# EAGLE design ControlBoard (EAGLE 8.1.0)

## Sheet 1 of 8
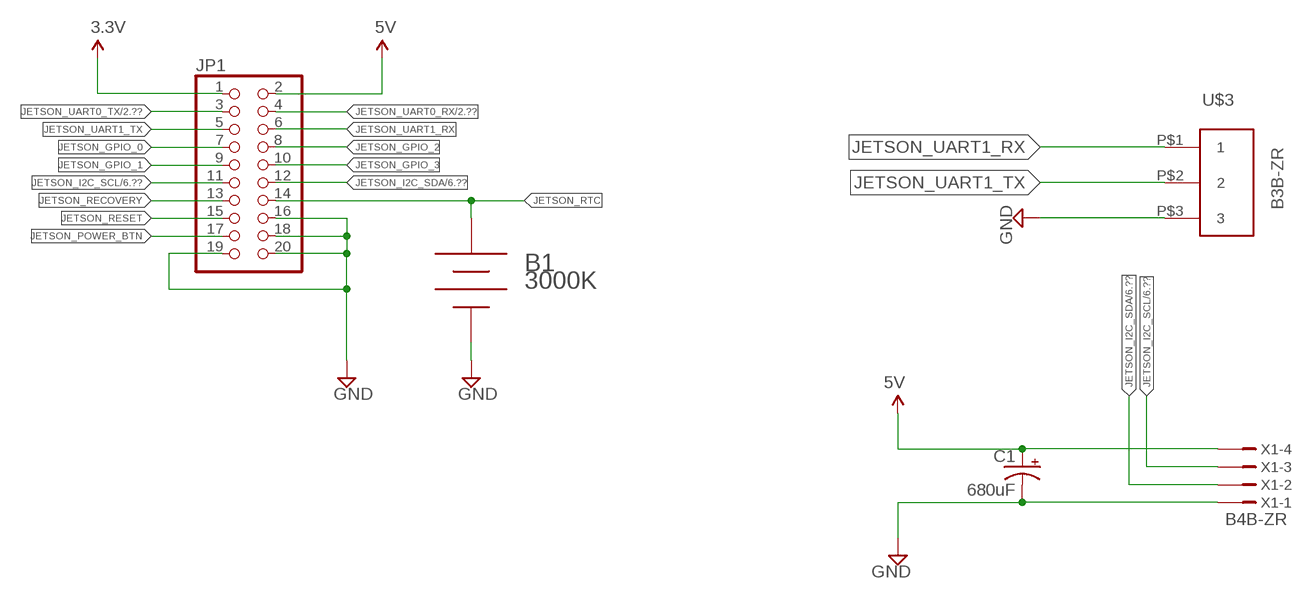
[diagram p0: schematic, sheet 1]

### Parts
B1  3000K  [3000K]
C1  680uF  CAP_POLPTH4  [CPOL-RADIAL-1000UF-25V]
JP1  PINHD-2X10  [2X10]
U$3  B3B-ZR  [3PIN-1.5MM]
X1  B4B-ZR  [B4B-ZR]

### Nets
3.3V: JP1.1 ; also sheet 2,4
5V: C1.+ JP1.2 X1.4 ; also sheet 2,5,6,8
GND: B1.- C1.- JP1.16 JP1.18 JP1.19 JP1.20 U$3.P$3 X1.1 ; also sheet 2,3,4,5,6,7,8
JETSON_GPIO_0: JP1.7
JETSON_GPIO_1: JP1.9
JETSON_GPIO_2: JP1.8
JETSON_GPIO_3: JP1.10
JETSON_I2C_SCL: JP1.11 X1.3 ; also sheet 6
JETSON_I2C_SDA: JP1.12 X1.2 ; also sheet 6
JETSON_POWER_BTN: JP1.17
JETSON_RECOVERY: JP1.13
JETSON_RESET: JP1.15
JETSON_RTC: B1.+ JP1.14
JETSON_UART0_RX: JP1.4 ; also sheet 2
JETSON_UART0_TX: JP1.3 ; also sheet 2
JETSON_UART1_RX: JP1.6 U$3.P$1
JETSON_UART1_TX: JP1.5 U$3.P$2

## Sheet 2 of 8
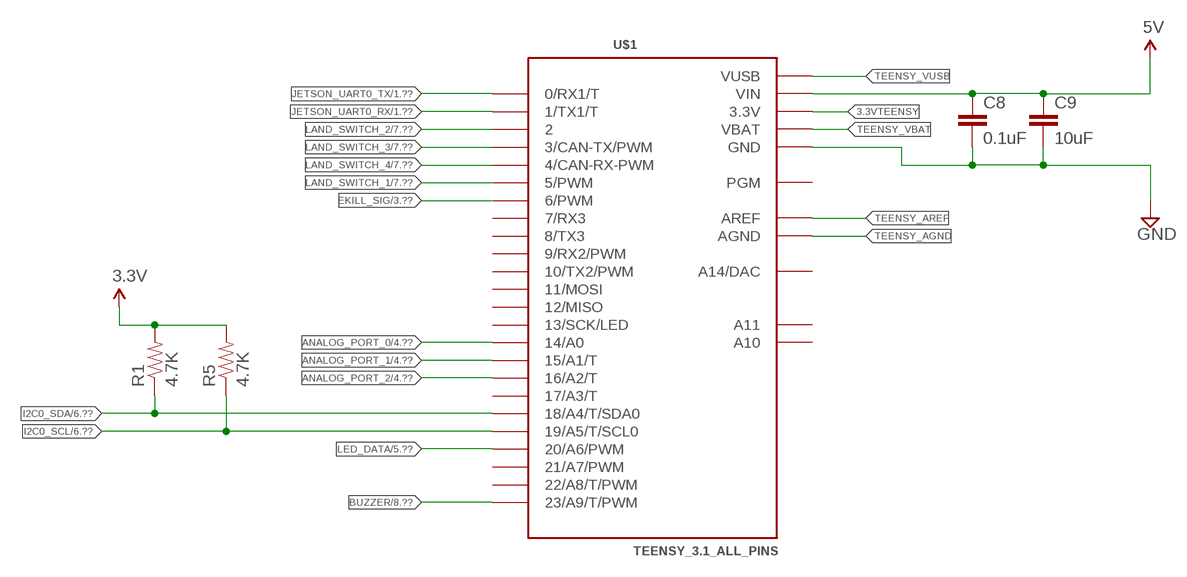
[diagram p1: schematic, sheet 2]

### Parts
C8  0.1uF  CAP0603-CAP  [0603-CAP]
C9  10uF  CAP0603-CAP  [0603-CAP]
R1  4.7K  RESISTOR0603  [0603-RES]
R5  4.7K  RESISTOR0603  [0603-RES]
U$1  TEENSY_3.1_ALL_PINS  [TEENSY3-ALL_PINS]

### Nets
3.3V: R1.2 R5.2 ; also sheet 1,4
3.3VTEENSY: U$1.3.3V U$1.3.3V1(3.3V)
5V: C8.1 C9.1 U$1.VIN ; also sheet 1,5,6,8
ANALOG_PORT_0: U$1.14/A0 ; also sheet 4
ANALOG_PORT_1: U$1.15/A1(15/A1/T) ; also sheet 4
ANALOG_PORT_2: U$1.16/A2(16/A2/T) ; also sheet 4
BUZZER: U$1.23/A9(23/A9/T/PWM) ; also sheet 8
EKILL_SIG: U$1.6(6/PWM) ; also sheet 3
GND: C8.2 C9.2 U$1.GND U$1.GND1(GND) ; also sheet 1,3,4,5,6,7,8
I2C0_SCL: R5.1 U$1.19/A5(19/A5/T/SCL0) ; also sheet 6
I2C0_SDA: R1.1 U$1.18/A4(18/A4/T/SDA0) ; also sheet 6
JETSON_UART0_RX: U$1.1(1/TX1/T) ; also sheet 1
JETSON_UART0_TX: U$1.0(0/RX1/T) ; also sheet 1
LAND_SWITCH_1: U$1.5(5/PWM) ; also sheet 7
LAND_SWITCH_2: U$1.2 ; also sheet 7
LAND_SWITCH_3: U$1.3(3/CAN-TX/PWM) ; also sheet 7
LAND_SWITCH_4: U$1.4(4/CAN-RX-PWM) ; also sheet 7
LED_DATA: U$1.20/A6(20/A6/PWM) ; also sheet 5
TEENSY_AGND: U$1.AGND
TEENSY_AREF: U$1.AREF
TEENSY_VBAT: U$1.VBAT
TEENSY_VUSB: U$1.VUSB
Unconnected: U$1.7(7/RX3) U$1.8(8/TX3) U$1.9(9/RX2/PWM) U$1.10(10/TX2/PWM) U$1.11(11/MOSI) U$1.12(12/MISO) U$1.13(13/SCK/LED) U$1.17/A3(17/A3/T) U$1.21/A7(21/A7/PWM) U$1.22/A8(22/A8/T/PWM) U$1.A10 U$1.A11 U$1.PGM U$1.RESET/DAC(A14/DAC)

## Sheet 3 of 8
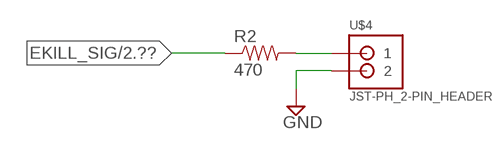
[diagram p2: schematic, sheet 3]

### Parts
R2  470  RESISTOR0603  [0603-RES]
U$4  JST-PH_2-PIN_HEADER  [JST_B2B-PH_HEADER]

### Nets
EKILL_SIG: R2.1 ; also sheet 2
GND: U$4.P2 ; also sheet 1,2,4,5,6,7,8
N$4: R2.2 U$4.P1

## Sheet 4 of 8
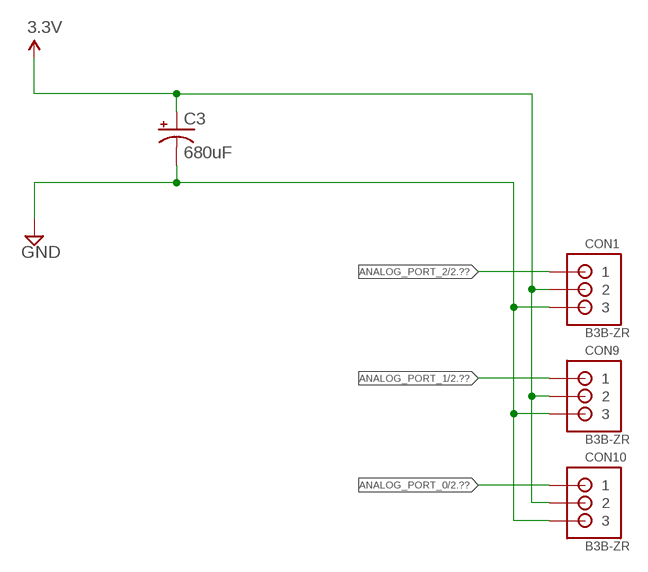
[diagram p3: schematic, sheet 4]

### Parts
C3  680uF  CAP_POLPTH4  [CPOL-RADIAL-1000UF-25V]
CON1  B3B-ZR  [B3B-ZR]
CON9  B3B-ZR  [B3B-ZR]
CON10  B3B-ZR  [B3B-ZR]

### Nets
3.3V: C3.+ CON1.2 CON9.2 CON10.2 ; also sheet 1,2
ANALOG_PORT_0: CON10.1 ; also sheet 2
ANALOG_PORT_1: CON9.1 ; also sheet 2
ANALOG_PORT_2: CON1.1 ; also sheet 2
GND: C3.- CON1.3 CON9.3 CON10.3 ; also sheet 1,2,3,5,6,7,8

## Sheet 5 of 8
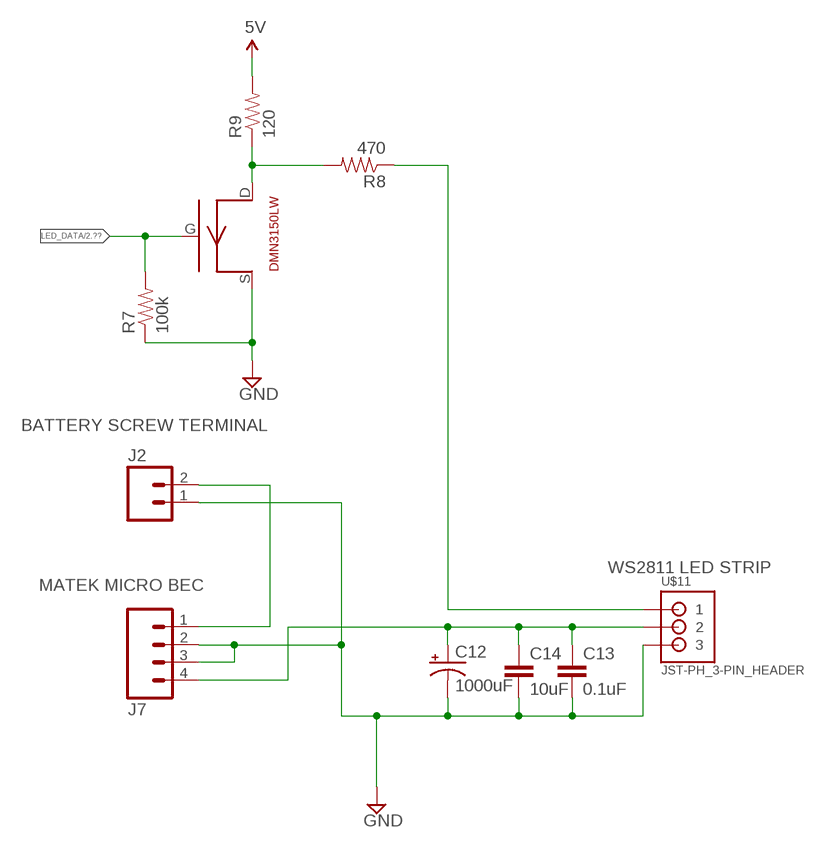
[diagram p4: schematic, sheet 5]

### Parts
C12  1000uF  CAP_POLPTH4  [CPOL-RADIAL-1000UF-25V]
C13  0.1uF  CAP0603-CAP  [0603-CAP]
C14  10uF  CAP0603-CAP  [0603-CAP]
J2  M025MM  [SCREWTERMINAL-5MM-2]
J7  M04PTH  [1X04]
R7  100k  RESISTOR0603-RES  [0603-RES]
R8  470  RESISTOR0603  [0603-RES]
R9  120  RESISTOR0603  [0603-RES]
U$2  DMN3150LW  [DMN3150LW]
U$11  JST-PH_3-PIN_HEADER  [JST_B3B-PH_HEADER]

### Nets
5V: R9.2 ; also sheet 1,2,6,8
GND: C12.2(-) C13.2 C14.2 J2.1 J7.2 J7.3 R7.1 U$2.S U$11.P3 ; also sheet 1,2,3,4,6,7,8
LED_DATA: R7.2 U$2.G ; also sheet 2
N$10: J2.2 J7.1
N$14: C12.1(+) C13.1 C14.1 J7.4 U$11.P2
N$15: R8.1 U$11.P1
N$16: R8.2 R9.1 U$2.D

### Notes on the sheet
- BATTERY SCREW TERMINAL
- WS2811 LED STRIP
- MATEK MICRO BEC

## Sheet 6 of 8
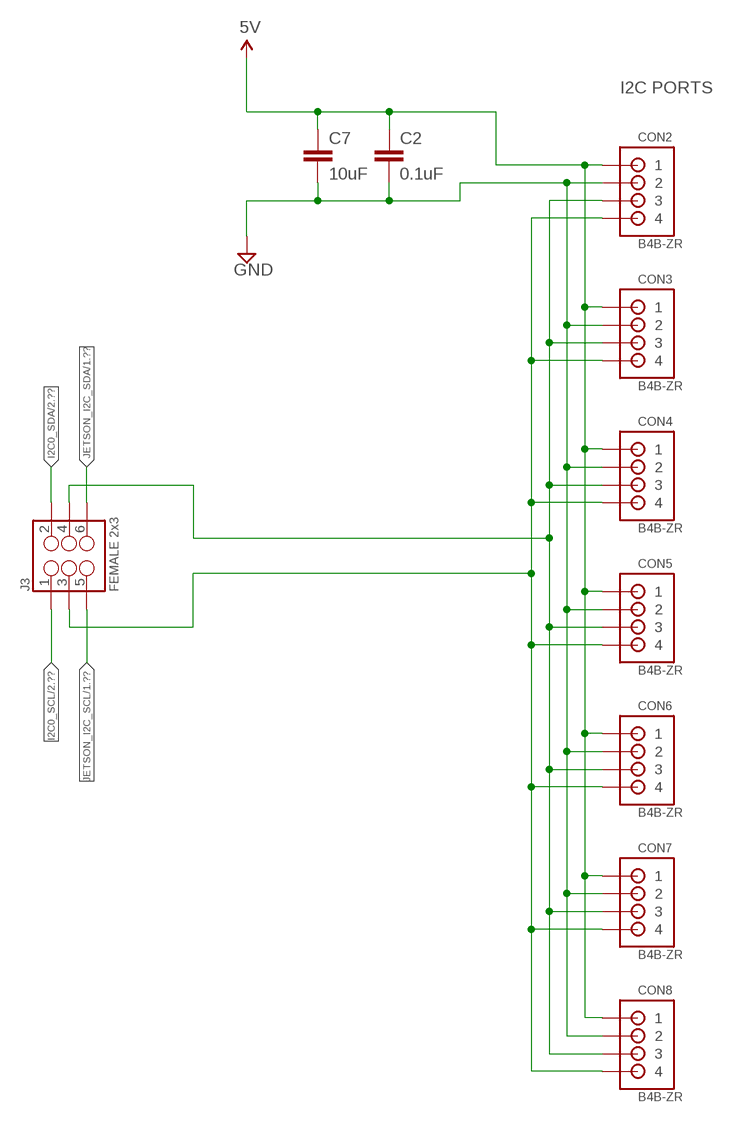
[diagram p5: schematic, sheet 6]

### Parts
C2  0.1uF  CAP0603-CAP  [0603-CAP]
C7  10uF  CAP0603-CAP  [0603-CAP]
CON2  B4B-ZR  [B4B-ZR]
CON3  B4B-ZR  [B4B-ZR]
CON4  B4B-ZR  [B4B-ZR]
CON5  B4B-ZR  [B4B-ZR]
CON6  B4B-ZR  [B4B-ZR]
CON7  B4B-ZR  [B4B-ZR]
CON8  B4B-ZR  [B4B-ZR]
J3  FEMALE 2x3  M03X2FEMALE  [2X3]

### Nets
5V: C2.1 C7.1 CON2.1 CON3.1 CON4.1 CON5.1 CON6.1 CON7.1 CON8.1 ; also sheet 1,2,5,8
GND: C2.2 C7.2 CON2.2 CON3.2 CON4.2 CON5.2 CON6.2 CON7.2 CON8.2 ; also sheet 1,2,3,4,5,7,8
I2C0_SCL: J3.1 ; also sheet 2
I2C0_SDA: J3.2 ; also sheet 2
JETSON_I2C_SCL: J3.5 ; also sheet 1
JETSON_I2C_SDA: J3.6 ; also sheet 1
N8: CON2.4 CON3.4 CON4.4 CON5.4 CON6.4 CON7.4 CON8.4 J3.3
N9: CON2.3 CON3.3 CON4.3 CON5.3 CON6.3 CON7.3 CON8.3 J3.4

### Notes on the sheet
- I2C PORTS

## Sheet 7 of 8
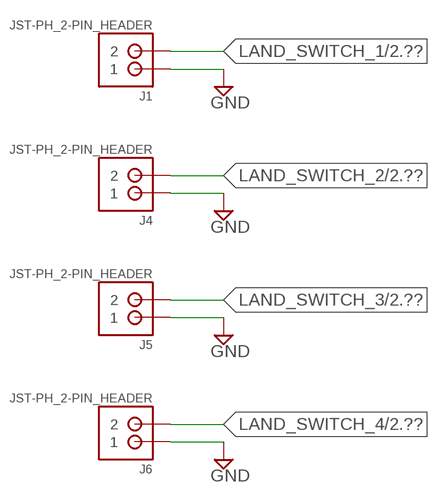
[diagram p6: schematic, sheet 7]

### Parts
J1  JST-PH_2-PIN_HEADER  [JST_B2B-PH_HEADER]
J4  JST-PH_2-PIN_HEADER  [JST_B2B-PH_HEADER]
J5  JST-PH_2-PIN_HEADER  [JST_B2B-PH_HEADER]
J6  JST-PH_2-PIN_HEADER  [JST_B2B-PH_HEADER]

### Nets
GND: J1.P1 J4.P1 J5.P1 J6.P1 ; also sheet 1,2,3,4,5,6,8
LAND_SWITCH_1: J1.P2 ; also sheet 2
LAND_SWITCH_2: J4.P2 ; also sheet 2
LAND_SWITCH_3: J5.P2 ; also sheet 2
LAND_SWITCH_4: J6.P2 ; also sheet 2

## Sheet 8 of 8
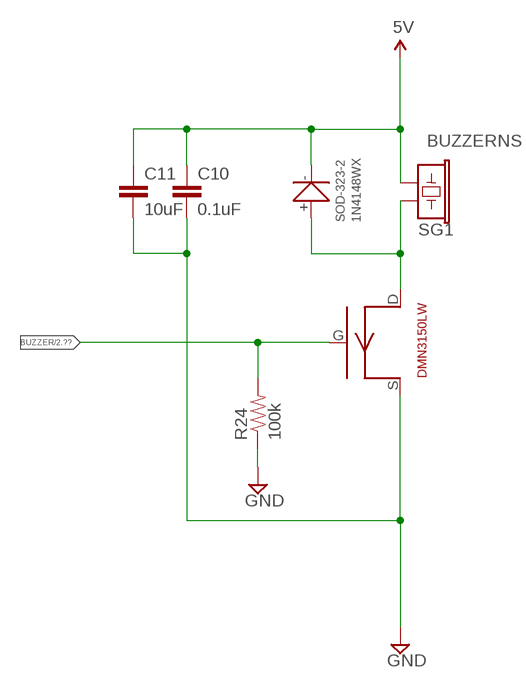
[diagram p7: schematic, sheet 8]

### Parts
C10  0.1uF  CAP0603-CAP  [0603-CAP]
C11  10uF  CAP0603-CAP  [0603-CAP]
R24  100k  RESISTOR0603-RES  [0603-RES]
SG1  BUZZERNS  [BUZZER-12MM-NS]
U$8  1N4148WX_SOD-323-2  [1N4148WX_SOD-323-2]
U$9  DMN3150LW  [DMN3150LW]

### Nets
5V: C10.1 C11.1 SG1.+ U$8.- ; also sheet 1,2,5,6
BUZZER: R24.2 U$9.G ; also sheet 2
GND: C10.2 C11.2 R24.1 U$9.S ; also sheet 1,2,3,4,5,6,7
N$12: SG1.- U$8.+ U$9.D

## Library data of the parts
B1 = b_keystone_3000k_sm_battery:3000K: SMT Battery Holder from Keystone for 12mm coin cells BR1216, CR1216, BR1220, CL1220, CR1220, BR1225
C1 C3 = SparkFun-Capacitors:CAP_POL: Capacitor Polarized These are standard SMD and PTH capacitors. Normally 10uF, 47uF, and 100uF in electrolytic and tantalum varieties. Always verify the external diameter of the through hole cap, it varies with capacity, voltage, and manufacturer. The EIA devices should be standard.
C2 C7 C13 C14 = SparkFun-Capacitors:CAP: Capacitor Standard 0603 ceramic capacitor, and 0.1" leaded capacitor.
C8-C11 = SparkFun-Passives:CAP: Capacitor Standard 0603 ceramic capacitor, and 0.1" leaded capacitor.
C12 = SparkFun-Passives:CAP_POL: Capacitor Polarized These are standard SMD and PTH capacitors. Normally 10uF, 47uF, and 100uF in electrolytic and tantalum varieties. Always verify the external diameter of the through hole cap, it varies with capacity, voltage, and manufacturer. The EIA devices should be standard.
CON1 CON9 CON10 = jst:B3B-ZR: JST-ZH Connector 3 pol, 1.5mm pitch Package: B3B-ZR Source: http://www.jst-mfg.com/product/pdf/eng/eZH.pdf
CON2-CON8 = jst:B4B-ZR: JST-ZH Connector 4 pol, 1.5mm pitch Package: B4B-ZR Source: http://www.jst-mfg.com/product/pdf/eng/eZH.pdf
J1 J4-J6 U$4 = SRG:JST-PH_2-PIN_HEADER: 2-pin JST PH Shrouded Header, top entry P/N B2B-PH-K-S Mating connector PHR-2 Mating cable assembly: Sparkfun PRT-09914 <http://www.sparkfun.com/products/9914>
J2 = SparkFun-Connectors:M02: Standard 2-pin 0.1" header. Use with - straight break away headers ( PRT-00116) - right angle break away headers (PRT-00553) - swiss pins (PRT-00743) - machine pins (PRT-00117) - female headers (PRT-00115) Molex polarized connector foot print use with: PRT-08233 with associated crimp pins and housings. 2.54_SCREWTERM for use with PRT-10571. 3.5mm Screw Terminal footprints for PRT-08084 5mm Screw Terminal footprints for use with PRT-08432; STOREFRONT_ID: PRT-08432
J3 = SparkFun-Connectors:M03X2: 2x3 .1" header. Shrouded, with keying- CONN-10681 SMT- CONN-11415 Pogo pins- HW-11044; PROD_ID: CONN-11566
J7 = SparkFun-Connectors:M04: Header 4 Standard 4-pin 0.1" header. Use with straight break away headers (SKU : PRT-00116), right angle break away headers (PRT-00553), swiss pins (PRT-00743), machine pins (PRT-00117), and female headers (PRT-00115). Molex polarized connector foot print use with SKU : PRT-08231 with associated crimp pins and housings. 1MM SMD Version SKU: PRT-10208; PROD_ID: CONN-09696
JP1 = pinhead:PINHD-2X10: PIN HEADER
R1 R2 R5 R8 R9 = SparkFun-Resistors:RESISTOR: Resistor Basic schematic elements and footprints for 0603, 1206, and PTH resistors.
R7 R24 = SparkFun-Passives:RESISTOR: Resistor Basic schematic elements and footprints for 0603, 1206, and PTH resistors.
SG1 = SparkFun-Electromechanical:BUZZER: Buzzer 12mm Spark Fun Electronics SKU : Comp-Buzzer
U$1 = Teensy_3_and_LC_Series_Boards_v1.1:TEENSY_3.1_ALL_PINS: Footprint for Teensy 3.1 or 3.2 board using all through-holes, i.e. the entire perimeter plus the 4 through-holes inboard (A10,A11,AREF, VUSB)
U$2 U$9 = DMN3150LW:DMN3150LW
U$3 = Levi-ZH:B3B-ZR: B3B-ZH 1.5mm
U$8 = 1N4148WX_SOD-323-2:1N4148WX_SOD-323-2
U$11 = SRG:JST-PH_3-PIN_HEADER: 3-pin JST PH Shrouded Header, top entry P/N B3B-PH-K-S Mating connector PHR-3
X1 = con-jst:?4B-ZR: ZH CONNECTOR 1.5 mm, 4 pin 1 row Source: http://www.jst.com .. eZH.pdf; MF: FARNELL; MPN: B4B-ZR(LF)(SN); OC_FARNELL: 1830916; OC_NEWARK: 37K9960

## Board
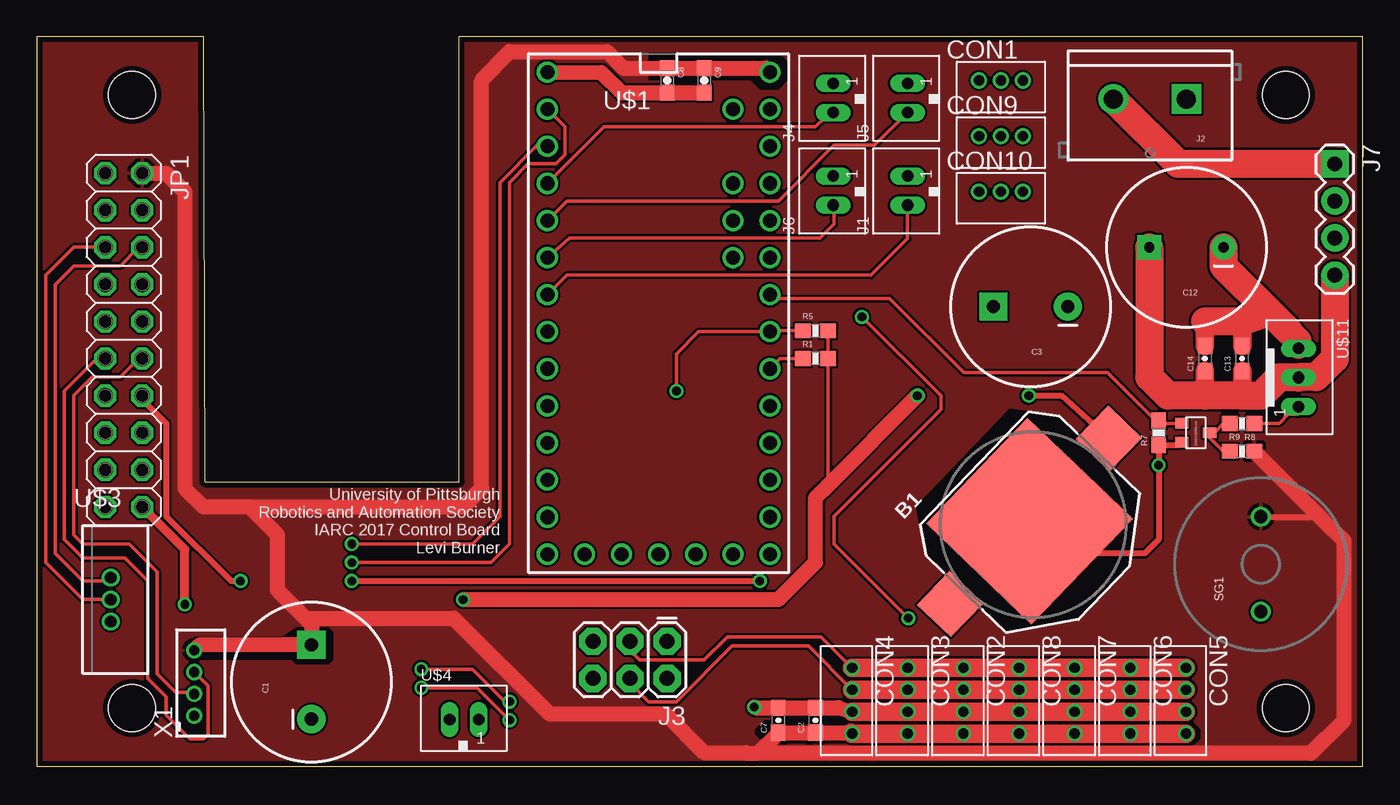
[diagram p8: board, top side]
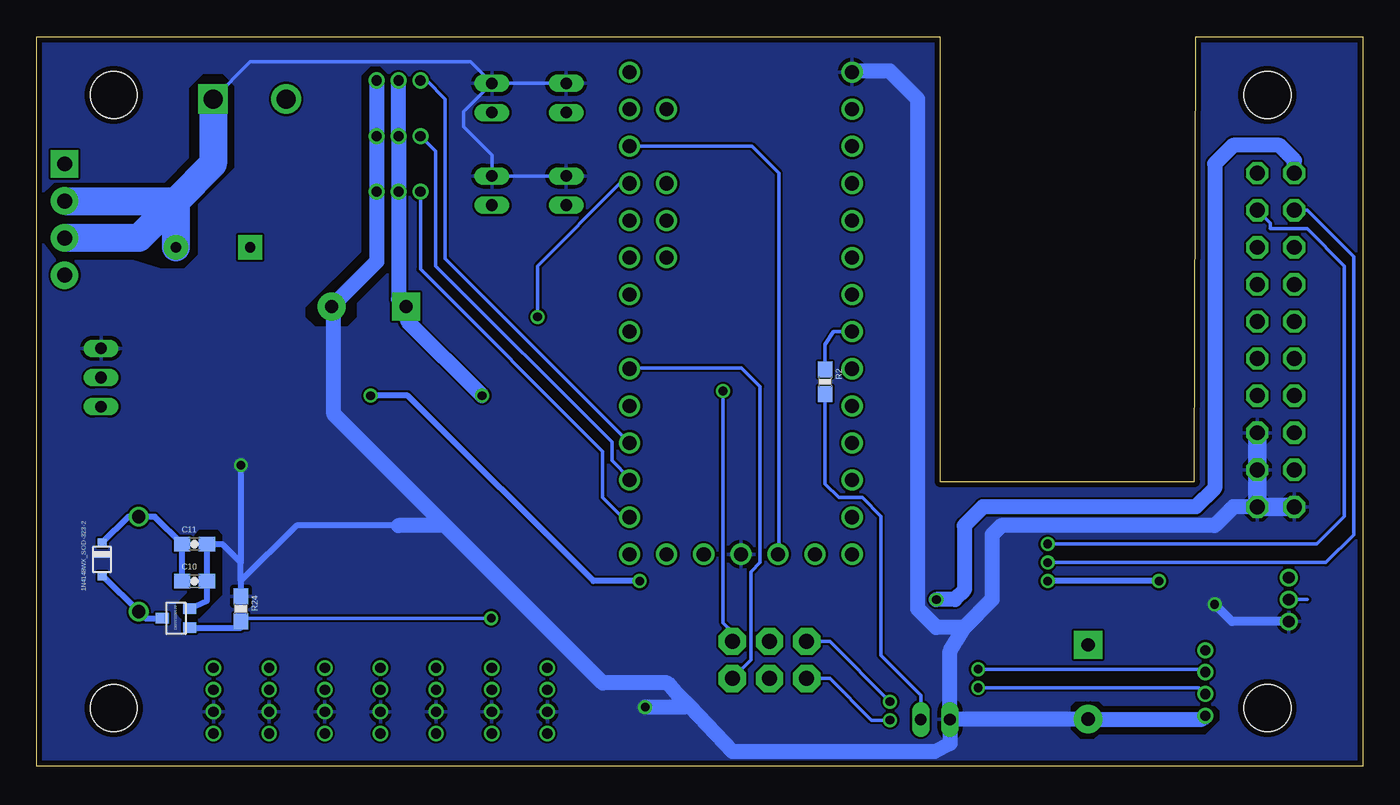
[diagram p9: board, bottom side, seen from below]

Size 90.81 x 50 mm. Coordinates in mm from the lower left corner, seen from the top.
Outline: 0,0 90.81,0 90.81,50 28.94,50 28.94,19.5 11.54,19.5 11.44,50 0,50 0,0
Copper layers (1*16): Top 0.0356mm / dielectric 1.5011mm / Bottom 0.0356mm
Design rules "LaenPCBOrder": minimum track width 6mil, minimum drill 13mil, track to track 6mil, track to pad 6mil, pad to pad 6mil, via to via 6mil, smd to smd 6mil, copper to edge 15mil, drill to drill 6mil, minimum pad ring 7mil, minimum via ring 7mil, stop-mask expansion 3mil, vias tented up to drill 0mil, thermal gap 10mil
Holes 3.2 mm at 6.54,46 6.54,4 85.54,4 85.54,46

### Footprints (pad centres in the part's own frame; a part is rotated, then mirrored left to right if it is on the bottom)
3000K = smd 3.2 x 3.2: + 7.85,0.35; ++ -7.85,0.35 | smd 10 x 10: - 0,0.35
CPOL-RADIAL-1000UF-25V = drill 0.9 pad 1.93 square: + 2.54,0 | drill 0.9 pad 1.93: - -2.54,0
0603-CAP = smd 1.1 x 1: 1 -0.85,0; 2 0.85,0
CPOL-RADIAL-1000UF-25V' = drill 0.7 pad 1.651 square: 1 2.54,0 | drill 0.7 pad 1.651: 2 -2.54,0
B3B-ZR = drill 0.7 pad 1.1: 1 -1.5,0; 2 0,0; 3 1.5,0
B4B-ZR = drill 0.7: 1 6,-1.3; 2 4.5,-1.3; 3 3,-1.3; 4 1.5,-1.3
JST_B2B-PH_HEADER = drill 0.8 long: P1 1.075,0.048; P2 -0.925,0.048
SCREWTERMINAL-5MM-2 = drill 1.3 pad 2.032 square: 1 0,0 | drill 1.3 pad 2.032: 2 5,0
2X3 = drill 1.016 pad 1.88 octagon: 1 0,0; 2 0,2.54; 3 2.54,0; 4 2.54,2.54; 5 5.08,0; 6 5.08,2.54
1X04 = drill 1.016 pad 1.88 square: 1 0,0 | drill 1.016 pad 1.88: 2 2.54,0; 3 5.08,0; 4 7.62,0
2X10 = drill 1.016 octagon: 1 -11.43,-1.27; 2 -11.43,1.27; 3 -8.89,-1.27; 4 -8.89,1.27; 5 -6.35,-1.27; 6 -6.35,1.27; 7 -3.81,-1.27; 8 -3.81,1.27; 9 -1.27,-1.27; 10 -1.27,1.27; 11 1.27,-1.27; 12 1.27,1.27; 13 3.81,-1.27; 14 3.81,1.27; 15 6.35,-1.27; 16 6.35,1.27; 17 8.89,-1.27; 18 8.89,1.27; 19 11.43,-1.27; 20 11.43,1.27
0603-RES = smd 1.1 x 1: 1 -0.85,0; 2 0.85,0
BUZZER-12MM-NS = drill 0.9: + 3.25,0; - -3.25,0
TEENSY3-ALL_PINS = drill 0.965: 0 -7.62,13.97; 1 -7.62,11.43; 2 -7.62,8.89; 3 -7.62,6.35; 3.3V 7.62,11.43; 3.3V1 -2.54,-16.51; 4 -7.62,3.81; 5 -7.62,1.27; 6 -7.62,-1.27; 7 -7.62,-3.81; 8 -7.62,-6.35; 9 -7.62,-8.89; 10 -7.62,-11.43; 11 -7.62,-13.97; 12 -7.62,-16.51; 13 7.62,-16.51; 14/A0 7.62,-13.97; 15/A1 7.62,-11.43; 16/A2 7.62,-8.89; 17/A3 7.62,-6.35; 18/A4 7.62,-3.81; 19/A5 7.62,-1.27; 20/A6 7.62,1.27; 21/A7 7.62,3.81; 22/A8 7.62,6.35; 23/A9 7.62,8.89; A10 5.08,6.35; A11 5.08,3.81; AGND 7.62,13.97; AREF 5.08,8.89; GND -7.62,16.51; GND1 0,-16.51; PGM 2.54,-16.51; RESET/DAC 5.08,-16.51; VBAT -5.08,-16.51; VIN 7.62,16.51; VUSB 5.08,13.97
DMN3150LW = smd 0.7 x 0.9: D 0,0.95; G -0.65,-0.95; S 0.65,-0.95
3PIN-1.5MM = drill 0.8: P$1 0,1.5; P$2 0,0; P$3 0,-1.5
1N4148WX_SOD-323-2 = smd 0.6 x 0.6: + -0.935,-0.035; - 1.365,-0.035
JST_B3B-PH_HEADER = drill 0.8 long: P1 2.027,0.048; P2 0.028,0.048; P3 -1.972,0.048
B4B-ZR' = drill 0.7 pad 1.1: 1 -2.25,0; 2 -0.75,0; 3 0.75,0; 4 2.25,0

### Placement (x,y rotation side)
B1  68.25,16.56 46.2 top
C1  18.82,5.79 90 top
C2  53.34,3.17 90 top
C3  68.07,31.5 180 top
C7  50.8,3.17 90 top
C8  43.18,46.99 270 top
C9  45.72,46.99 270 top
C10  80.01,12.7 0 bottom
C11  80.01,15.24 0 bottom
C12  1000uF  [CPOL-RADIAL-1000UF-25V']  78.74,35.56 180 top
C13  82.55,27.94 90 top
C14  80.01,27.94 90 top
CON1  66.04,46.99 0 top
CON2  64.77,8.26 270 top
CON3  60.96,8.26 270 top
CON4  57.15,8.26 270 top
CON5  80.01,8.26 270 top
CON6  76.2,8.26 270 top
CON7  72.39,8.26 270 top
CON8  68.58,8.26 270 top
CON9  66.04,43.18 0 top
CON10  66.04,39.37 0 top
J1  59.69,39.37 90 top
J2  78.74,45.72 180 top
J3  43.18,8.57 180 top
J4  54.61,45.72 90 top
J5  59.69,45.72 90 top
J6  54.61,39.37 90 top
J7  88.9,41.27 270 top
JP1  5.97,29.21 270 top
R1  53.34,27.94 0 top
R2  36.83,26.35 270 bottom
R5  53.34,29.84 0 top
R7  76.83,22.86 90 top
R8  82.55,23.5 180 top
R9  82.55,21.59 0 top
R24  76.83,10.79 270 bottom
SG1  83.83,13.86 90 top
U$1  42.6,31.05 0 top
U$2  79.38,22.86 270 top
U$3  5.08,11.43 0 top
U$4  29.21,3.17 0 top
U$8  86.36,13.97 90 bottom
U$9  81.28,10.16 90 bottom
U$11  86.36,26.67 270 top
X1  B4B-ZR  [B4B-ZR']  10.79,5.71 90 top

### Tracks (layer width: path | path; a pad name or v marks a point on that pad's centre or on a via)
3.3V  (via drill 0.6)
  Top 0.254: R5.2 R1.2 54.19,19.27
  Top 1.016: v29.21,11.43 50.8,11.43 53.34,13.97 53.34,18.41 54.19,19.27 v60.33,25.4
  Bottom 1.016: JP1.1 4.7,41.53 5.71,42.55 8.89,42.55 10.16,41.27 10.16,19.05 11.43,17.78 26.04,17.78 27.3,16.51 27.3,12.06 27.94,11.43 v29.21,11.43 | CON1.2 CON9.2 CON10.2 66.04,32 C3.+ 65.41,31.37 65.41,30.48 v60.33,25.4
3.3VTEENSY
  Bottom 0.254: U$1.3.3V1 40.01,14.6 40.01,40.64 41.84,42.48 U$1.3.3V
5V
  Top 0.254: 55.24,2.54 55.78,2.33 | 53.34,2.54 C2.1 | C7.1 50.8,2.54
  Top 0.406: SG1.+ 87.88,17.11 88.06,16.93
  Top 1.016: JP1.2 8.89,40.64 10.16,39.37 10.16,19.05 11.43,17.78 14.61,17.78 | 18.41,10.16 28.57,10.16 35.14,3.6 43.08,3.6 45.72,0.95 48.58,0.95 48.64,0.89 49.36,0.89 | 14.61,17.78 29.21,17.78 30.48,19.05 30.48,46.99 32.38,48.96 39.05,48.96 40.17,47.84 C8.1 C9.1 49.94,47.84 U$1.VIN | 14.61,17.78 16.51,15.88 16.51,12.06 18.41,10.16 | 55.78,2.33 C2.1 C7.1 49.36,0.89 | X1.4 11.15,8.32 C1.+ 18.82,9.75 18.41,10.16 | R9.2 88.06,16.93 89.53,15.46 89.53,3.17 87.25,0.89 49.36,0.89
  Top 1.27: CON5.1 CON6.1 CON7.1 CON8.1 CON2.1 CON3.1 CON4.1 55.78,2.33
  Bottom 0.254: U$8.- 86.36,15.24
  Bottom 0.406: U$8.- 84.55,17.11 SG1.+ 82.73,17.11 C11.1 C10.1
  pour Top: -1.91,-2.54 -1.91,52.7 94.61,52.7 94.61,-3.81 -1.91,-3.81
ANALOG_PORT_0
  Bottom 0.254: CON10.1 64.54,34.06 52.07,21.59 52.07,18.41 50.73,17.08 U$1.14/A0
ANALOG_PORT_1
  Bottom 0.254: CON9.1 63.5,42.14 63.5,34.29 51.44,22.23 51.44,20.95 50.22,19.74 U$1.15/A1
ANALOG_PORT_2
  Bottom 0.254: U$1.16/A2 62.87,34.8 62.87,45.72 64.14,46.99 CON1.1
BUZZER  (via drill 0.6)
  Top 0.254: v59.69,10.16 54.61,15.24 54.61,17.14 61.91,24.45 61.91,25.4 v56.52,30.8
  Bottom 0.254: v59.69,10.16 76.62,10.16 R24.2 | U$1.23/A9 50.87,39.94 56.52,34.29 v56.52,30.8
  Bottom 0.406: U$9.G 76.83,9.51 R24.2
EKILL_SIG
  Bottom 0.254: U$1.6 36.26,29.78 36.83,28.89 R2.1
GND  (via drill 0.6)
  Top 0.406: 76.62,22.23 R7.1 | R7.1 78.22,22.01 U$2.S | R7.1 v76.83,20.64 76.83,15.56 75.88,14.61 70.19,14.61 B1.-
  Top 0.61: JP1.20 10.16,14.86 v10.16,11.11
  Top 1.016: C9.2 C8.2 40.08,46.14 38.69,47.54 U$1.GND | CON4.2 54.95,4.03 C2.2 C7.2 49.24,4.03 v49.15,4.06
  Top 1.27: C14.2 80.01,30.48 | C13.2 82.55,30.48 | CON5.2 CON6.2 CON7.2 CON8.2 CON2.2 CON3.2 CON4.2
  Top 1.422: 86.41,29.16 U$11.P3
  Top 1.778: 85.77,29.8 86.41,29.16
  Top 1.93: 84.45,31.11 85.77,29.8 | 80.01,30.48 82.55,30.48 84.45,31.11 | C12.2 81.28,34.29 84.45,31.11
  Bottom 0.254: J4.P1 J5.P1 | J6.P1 J1.P1 59.64,41.86 61.59,43.81 61.59,44.84 J5.P1 | J5.P1 61.11,48.26 76.2,48.26 J2.1 | U$1.GND 35.56,47.62
  Bottom 0.406: U$9.S 79.16,11.35 C10.2 C11.2 78.11,15.24 76.83,13.97 | 76.83,12.7 76.83,13.97 | 76.83,12.7 R24.1 | 66.04,16.51 73.03,16.51 76.83,12.7 | v76.83,20.64 76.83,13.97
  Bottom 0.61: U$3.P$3 8.98,9.93 v10.16,11.11
  Bottom 1.016: U$4.P2 28.29,1.56 29.34,1.02 43.18,1.02 46.07,4.08 | 46.07,4.08 47.03,5.06 47.62,5.71 52.07,5.71 62.87,16.51 | JP1.20 8.89,17.78 10.16,16.51 24.77,16.51 25.4,15.88 25.4,11.43 27.3,9.53 | 27.3,9.53 29.21,9.53 30.48,10.79 30.48,45.72 32.38,47.62 34.91,47.62 U$1.GND | U$4.P2 28.29,7.91 27.3,9.53 | 62.87,16.51 66.04,16.51 | 62.87,16.51 70.48,24.13 70.48,31.37 C3.- 67.54,34.57 CON10.3 CON9.3 CON1.3 | 18.89,3.17 C1.- | C1.- 11.02,3.25 X1.1 | C1.- 18.85,3.22 U$4.P2 | 46.07,4.08 46.47,4.06 v49.15,4.06
  Bottom 1.27: JP1.16 JP1.18 JP1.20 JP1.19
  Bottom 1.93: J2.1 78.74,41.27 81.28,38.73 | J7.2 81.28,38.73 | 81.28,38.73 83.82,36.2 J7.3 | C12.2 81.28,38.73
  pour Bottom: -1.27,-1.27 -1.27,51.44 93.34,51.44 93.34,-1.91 -1.27,-1.91
I2C0_SCL  (via drill 0.6)
  Top 0.254: v43.81,25.72 43.81,28.26 45.34,29.78 U$1.19/A5 50.28,29.84 R5.1
  Bottom 0.254: J3.1 43.18,9.21 43.81,9.84 v43.81,25.72
I2C0_SDA
  Top 0.254: U$1.18/A4 50.92,27.94 R1.1
  Bottom 0.254: J3.2 41.91,7.3 41.91,13.34 41.27,13.97 41.27,26.04 42.55,27.3 50.16,27.3 U$1.18/A4
JETSON_I2C_SCL  (via drill 0.6)
  Top 0.254: v26.35,6.67 29.84,6.67 32.07,4.45 v32.38,4.45 | JP1.11 4.13,27.94 1.91,25.72 1.91,15.56 3.17,14.29 6.03,14.29 7.62,12.7 7.62,6.03 8.89,4.76 8.89,3.49 10.48,1.91 11.43,1.91 11.75,2.22 11.75,5.51 X1.3
  Bottom 0.254: X1.3 11,6.67 v26.35,6.67 | v32.38,4.45 36.51,8.57 J3.5
JETSON_I2C_SDA  (via drill 0.6)
  Top 0.254: JP1.12 6.99,27.94 5.71,26.67 3.81,26.67 2.54,25.4 2.54,15.88 3.17,15.24 6.35,15.24 8.26,13.34 8.26,6.35 9.53,5.08 10.68,5.08 X1.2 | v26.35,5.4 30.16,5.4 v32.38,3.17
  Bottom 0.254: X1.2 11.23,5.4 v26.35,5.4 | v32.38,3.17 33.66,3.17 36.51,6.03 J3.6
JETSON_RTC  (via drill 0.6)
  Top 0.406: JP1.14 7.24,25.15 8.89,23.5 8.89,17.14 13.34,12.7 v13.97,12.7 | v21.59,12.7 v49.53,12.7 | v67.94,25.4 70.17,25.4 B1.+
  Bottom 0.406: v13.97,12.7 v21.59,12.7 | v49.53,12.7 52.7,12.7 65.41,25.4 v67.94,25.4
JETSON_UART0_RX  (via drill 0.6)
  Top 0.254: v21.59,15.24 29.84,15.24 31.75,17.14 31.75,40.01 34.29,42.55 34.91,42.55 U$1.1
  Bottom 0.254: JP1.4 6.35,37.21 6.35,36.83 3.81,36.83 1.27,34.29 1.27,17.14 3.17,15.24 v21.59,15.24
JETSON_UART0_TX  (via drill 0.6)
  Top 0.254: v21.59,13.97 31.11,13.97 32.38,15.24 32.38,40.01 33.66,41.27 35.56,41.27 36.2,41.91 36.2,43.81 36.19,43.81 U$1.0
  Bottom 0.254: JP1.3 3.81,38.1 0.64,34.92 0.64,15.88 2.54,13.97 v21.59,13.97
JETSON_UART1_RX
  Top 0.254: JP1.6 6.99,35.56 5.71,34.29 2.54,34.29 1.27,33.02 1.27,14.61 3.17,12.7 4.85,12.7 U$3.P$1
JETSON_UART1_TX
  Top 0.254: JP1.5 2.54,35.56 0.64,33.66 0.64,13.97 3.17,11.43 U$3.P$2
  Bottom 0.254: 3.81,11.43 U$3.P$2
LAND_SWITCH_1
  Top 0.254: 59.69,38.1 J1.P2 59.64,36.15 57.15,33.66 36.31,33.66 U$1.5
LAND_SWITCH_2
  Top 0.254: J4.P2 53.98,44.45 53.34,43.81 38.85,43.81 U$1.2
LAND_SWITCH_3
  Top 0.254: U$1.3 36.31,38.73 50.8,38.73 54.61,42.55 57.39,42.55 J5.P2
LAND_SWITCH_4
  Top 0.254: J6.P2 54.61,38.4 54.61,37.15 53.66,36.2 36.5,36.2 U$1.4
LED_DATA
  Top 0.254: U$2.G 78.11,23.5 76.83,23.5 R7.2 76.62,23.71 73.34,26.99 63.5,26.99 58.42,32.07 50.6,32.07 U$1.20/A6
N8
  Top 0.254: J3.3 40.64,7.94 41.27,7.3 45.72,7.3 47.31,8.89 53.72,8.89 CON4.4
  Top 1.27: CON5.4 CON6.4 CON7.4 CON8.4 CON2.4 CON3.4 CON4.4
N9
  Top 0.254: J3.4 40.64,5.71 41.91,4.45 43.81,4.45 47.62,8.26 52.85,8.26 CON4.3
  Top 1.27: CON4.3 CON3.3 CON2.3 CON8.3 CON7.3 CON6.3 CON5.3
N$1
  cutout Top: 41.91,46.99 48.9,46.99 49.53,46.35 50.8,46.35 51.44,46.99 51.44,48.26 50.8,48.9 41.91,48.9
N$2
  cutout Bottom: 77.28,46.61 77.28,41.02 79.79,38.51 79.79,35.05 80.71,34.13 82.36,34.13 84.23,34.73 89.44,34.73 90.55,36.16 90.55,39.05 89.63,39.97 82.04,39.97 80.36,41.66 80.36,46.45 79.41,47.4 78.07,47.4
N$3
  cutout Top: 49.85,1.59 55.56,1.59 55.88,1.27 79.06,1.27 79.69,1.91 79.69,2.54 79.38,2.86 79.06,3.17 49.85,3.17 49.21,2.54 49.21,2.22
N$4
  Bottom 0.254: R2.2 36.83,19.37 35.88,18.41 34.29,18.41 33.02,17.14 33.02,7.62 30.29,4.88 U$4.P1 30.33,3.17
N$5
  cutout Bottom: 78.11,15.88 78.11,11.75 79.69,10.16 80.96,10.16 81.28,10.48 81.28,11.11 80.96,11.43 80.01,12.38 80.01,15.88 79.69,16.19 78.42,16.19
N$6
  cutout Bottom: 69.53,30.16 71.75,30.16 72.39,30.8 72.39,31.43 68.58,35.24 68.58,47.31 67.94,47.94 67.31,47.94 66.67,47.31 66.67,33.97 68.9,31.75 68.9,30.8
N$7
  cutout Bottom: 9.84,3.17 10.79,2.22 18.1,2.22 18.41,1.91 19.37,1.91 20,2.54 20,4.13 19.68,4.45 18.1,4.45 17.78,4.13 10.16,4.13 9.84,3.81
N$8
  cutout Top: 10.48,7.3 17.46,7.3 17.78,6.99 20,6.99 20.32,7.3 20.32,9.21 20,9.53 17.78,9.53 16.83,8.89 10.79,8.89 10.16,8.26 10.16,7.62
N$10
  Top 1.93: J2.2 78.19,41.27 J7.1
N$12
  Bottom 0.406: U$8.+ 86.25,13.04 SG1.- 83.38,10.16 U$9.D
N$14
  Top 1.27: C14.1 80.01,25.4 | C13.1 82.55,25.4
  Top 1.93: J7.4 88.9,27.94 87.63,26.67 86.44,26.67 U$11.P2 86.38,26.67 85.09,26.67 83.82,25.4 82.55,25.4 80.01,25.4 77.47,25.4 76.2,26.67 C12.1
N$15
  Top 0.254: R8.1 85.09,23.5 85.72,24.13 86.36,24.13 U$11.P1
N$16
  Top 0.254: R8.2 81.28,23.5 80.64,22.86 U$2.D 80.01,22.86 81.28,21.59 R9.1

### Text on the board
tPlace: University of Pittsburgh / Robotics and Automation Society / IARC 2017 Control Board / Levi Burner